# Altium schematic sheet 06_AMPLIFIER_IQ.SchDoc
size A3; SheetNumber: 6; SheetTotal: 6
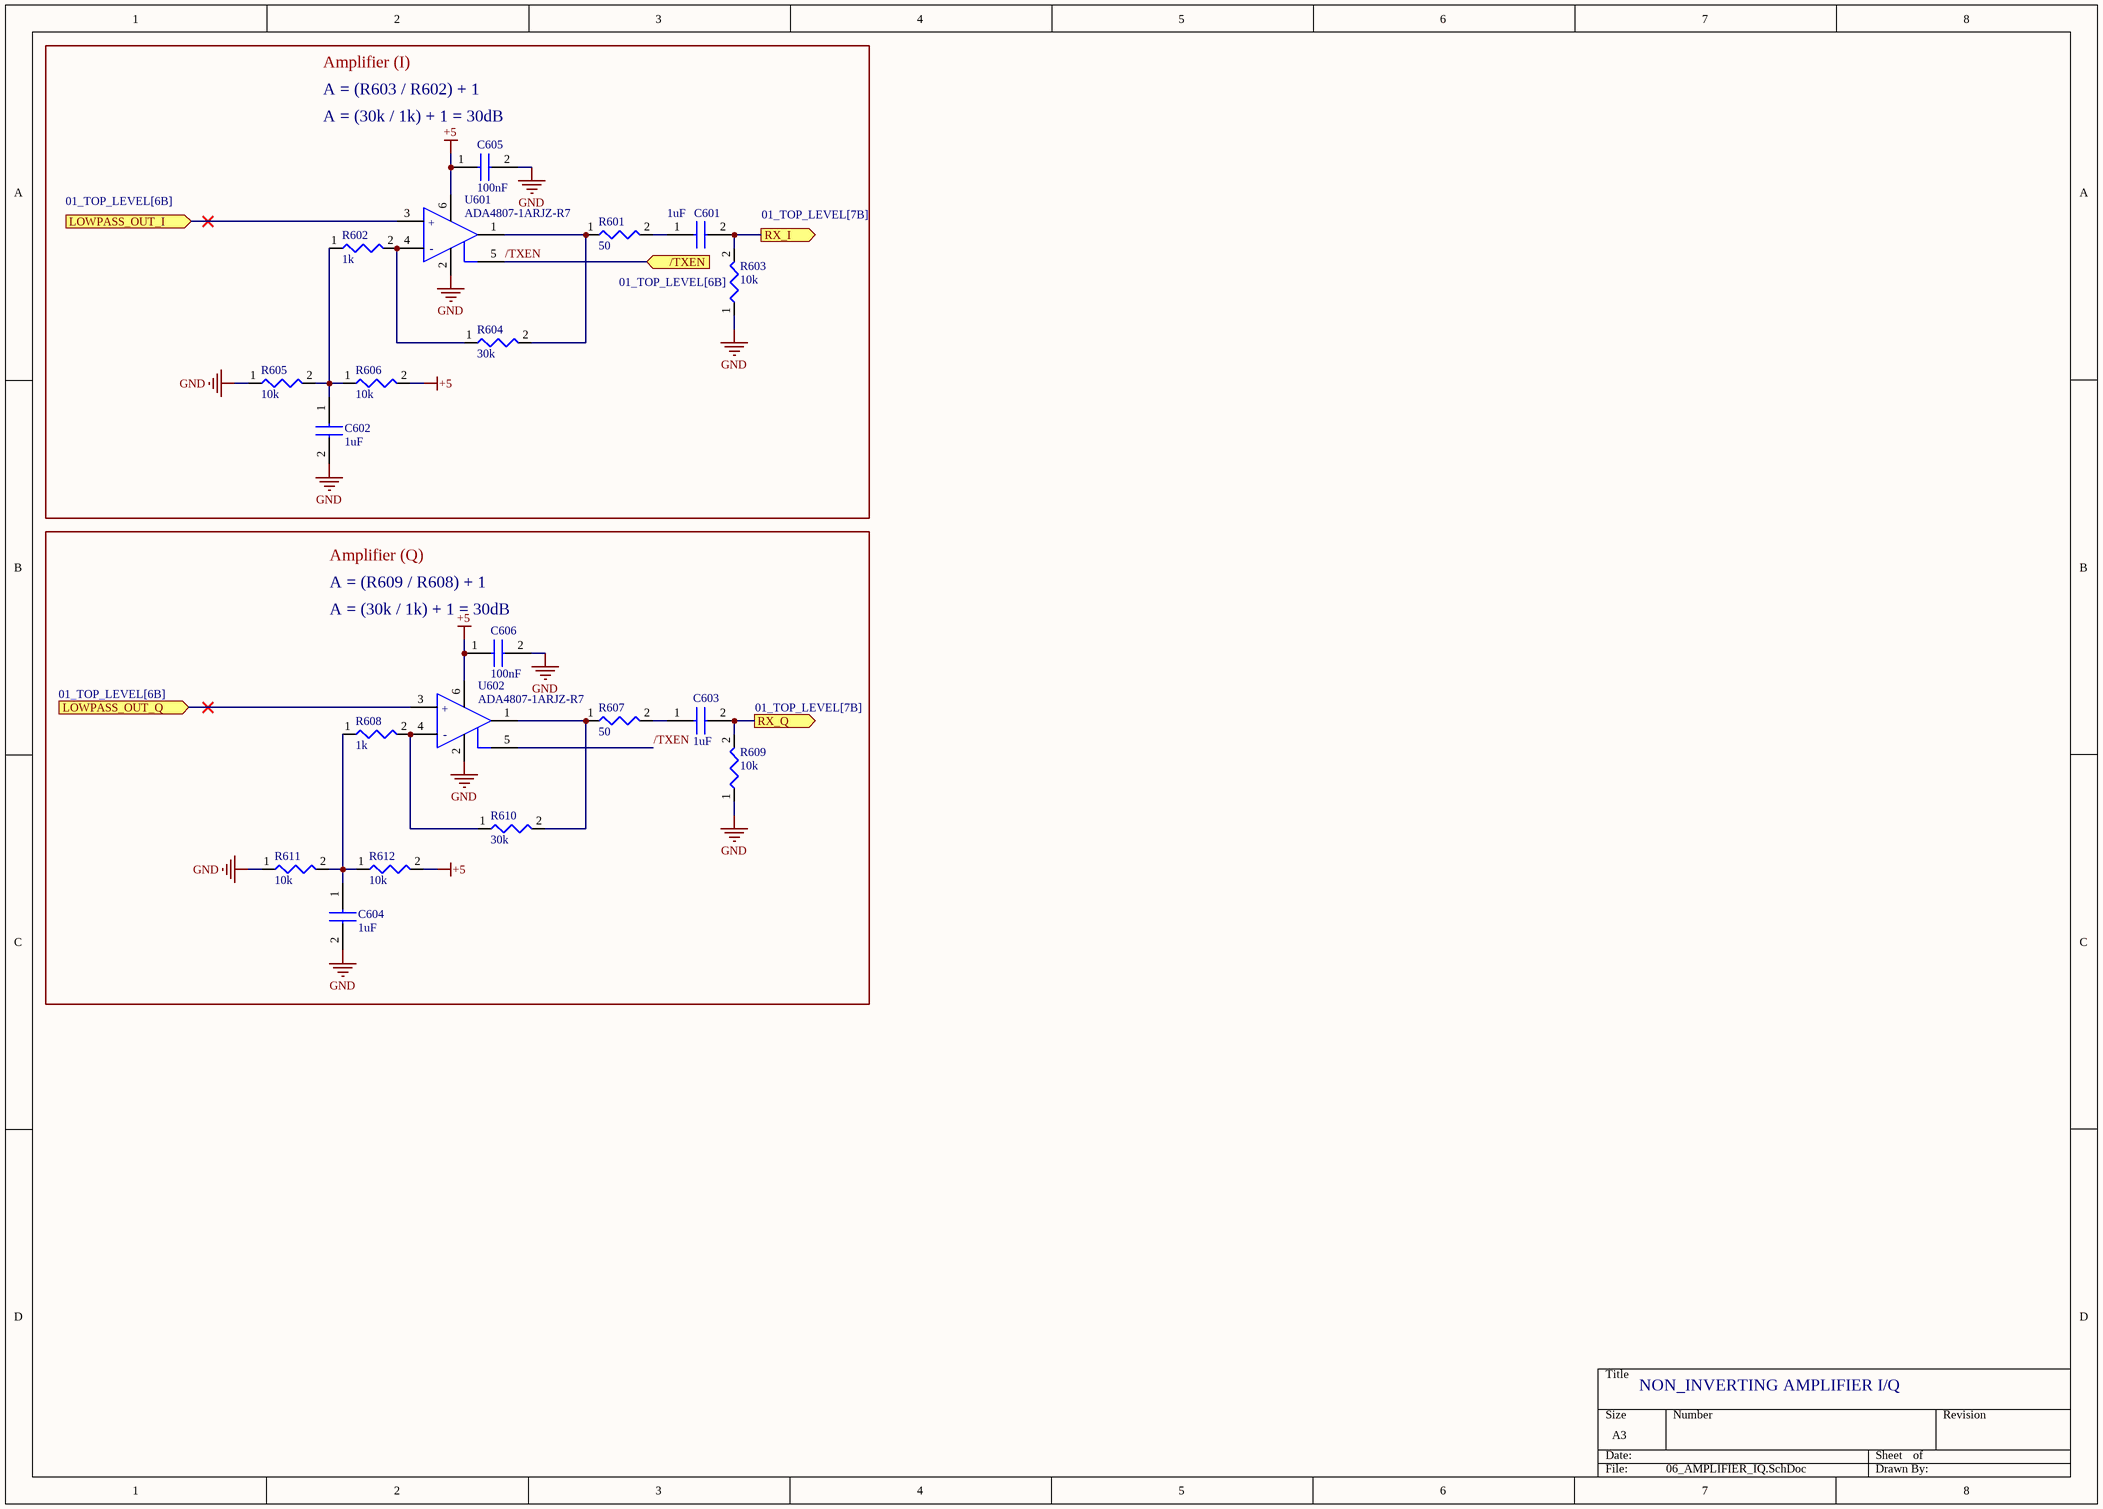
[diagram p0: 06_AMPLIFIER_IQ.SchDoc]

## Parts
C601  1uF  [CAP_0805]
C602  1uF  [CAP_0805]
C603  1uF  [CAP_0805]
C604  1uF  [CAP_0805]
C605  100nF  [CAP_0805]
C606  100nF  [CAP_0805]
R601  50  [RES_0805]
R602  1k  [RES_0805]
R603  10k  [RES_0805]
R604  30k  [RES_0805]
R605  10k  [RES_0805]
R606  10k  [RES_0805]
R607  50  [RES_0805]
R608  1k  [RES_0805]
R609  10k  [RES_0805]
R610  30k  [RES_0805]
R611  10k  [RES_0805]
R612  10k  [RES_0805]
U601  ADA4807-1ARJZ-R7  [FP-RJ-6-IPC_A]
U602  ADA4807-1ARJZ-R7  [FP-RJ-6-IPC_A]

## Ports
/TXEN (in, see 01_TOP_LEVEL[6B]), LOWPASS_OUT_I (in, see 01_TOP_LEVEL[6B]), LOWPASS_OUT_Q (in, see 01_TOP_LEVEL[6B]), RX_I (out, see 01_TOP_LEVEL[7B]), RX_Q (out, see 01_TOP_LEVEL[7B])

## Nets
+5: C605.1 C606.1 R606.2 R612.2 U601.6(+VS) U602.6(+VS)
GND: C602.2 C604.2 C605.2 C606.2 R603.1 R605.1 R609.1 R611.1 U601.2(-VS) U602.2(-VS)
/TXEN: U601.5(~{DISABLE}) U602.5(~{DISABLE}) ; port /TXEN
LOWPASS_OUT_I: U601.3(+IN) ; port LOWPASS_OUT_I
LOWPASS_OUT_Q: U602.3(+IN) ; port LOWPASS_OUT_Q
RX_I: C601.2 R603.2 ; port RX_I
RX_Q: C603.2 R609.2 ; port RX_Q
NetC601_1: C601.1 R601.2
NetC602_1: C602.1 R602.1 R605.2 R606.1
NetC603_1: C603.1 R607.2
NetC604_1: C604.1 R608.1 R611.2 R612.1
NetR601_1: R601.1 R604.2 U601.1(VOUT)
NetR602_2: R602.2 R604.1 U601.4(-IN)
NetR607_1: R607.1 R610.2 U602.1(VOUT)
NetR608_2: R608.2 R610.1 U602.4(-IN)

## Notes on the sheet
- Amplifier (I)
- A = (R603 / R602) + 1
- (near C605) A = (30k / 1k) + 1 = 30dB
- A = (R609 / R608) + 1
- Amplifier (Q)
- (near C606) A = (30k / 1k) + 1 = 30dB
- NON_INVERTING AMPLIFIER I/Q
- (in symbol CMP-09116-000179-1) +; -

## Library data of the parts
C601-C606 = CAP_0805: Capacitor SMD 0805; Height: 0.94mm
R601-R612 = RES_0805: Resistor SMD 0805
U601 U602 = CMP-09116-000179-1: IC OPAMP VFB 1 CIRCUIT SOT23-6; -3db Bandwidth: 180MHz; Max Frequency: 100kHz; Bandwidth: 200MHz; Min Supply Voltage: 3V; Max Input Voltage: 11V; Common Mode Rejection Ratio: 96dB; Power Supply Rejection Ratio (PSRR): 105dB; Output Current: 60mA; Input Offset Voltage (Vos): 20uV; Output Current per Channel: 106mA; Number of Circuits: 1; Min Input Voltage: 2.7V; Operating Supply Voltage: 10V; Input Bias Current: 1.2uA; Operating Supply Current: 950uA; Voltage Gain: 130dB; Slew Rate: 225V/µs; Dual Supply Voltage: 5V; Height: 1.3mm; Min Operating Temperature: -40°C; Mount: Surface Mount; Lead Free: Contains Lead; Gain Bandwidth Product: 200MHz; Contact Plating: Tin; Width: 1.7mm; Packaging: Cut Tape; Max Operating Temperature: 125°C; Case/Package: SOT-23-6; Number of Pins: 6; Length: 3mm; REACH SVHC: No SVHC; Max Supply Voltage: 11V; RoHS Compliant: Yes; Number of Amplifiers: 1; ComponentLink1Description: DigiKey; ComponentLink1URL: https://www.digikey.com/en/products/detail/analog-devices-inc/ADA4807-1ARJZ-R2/5057389